# EAGLE design dcmctrl-mcu-board_v1 (EAGLE 6.2)
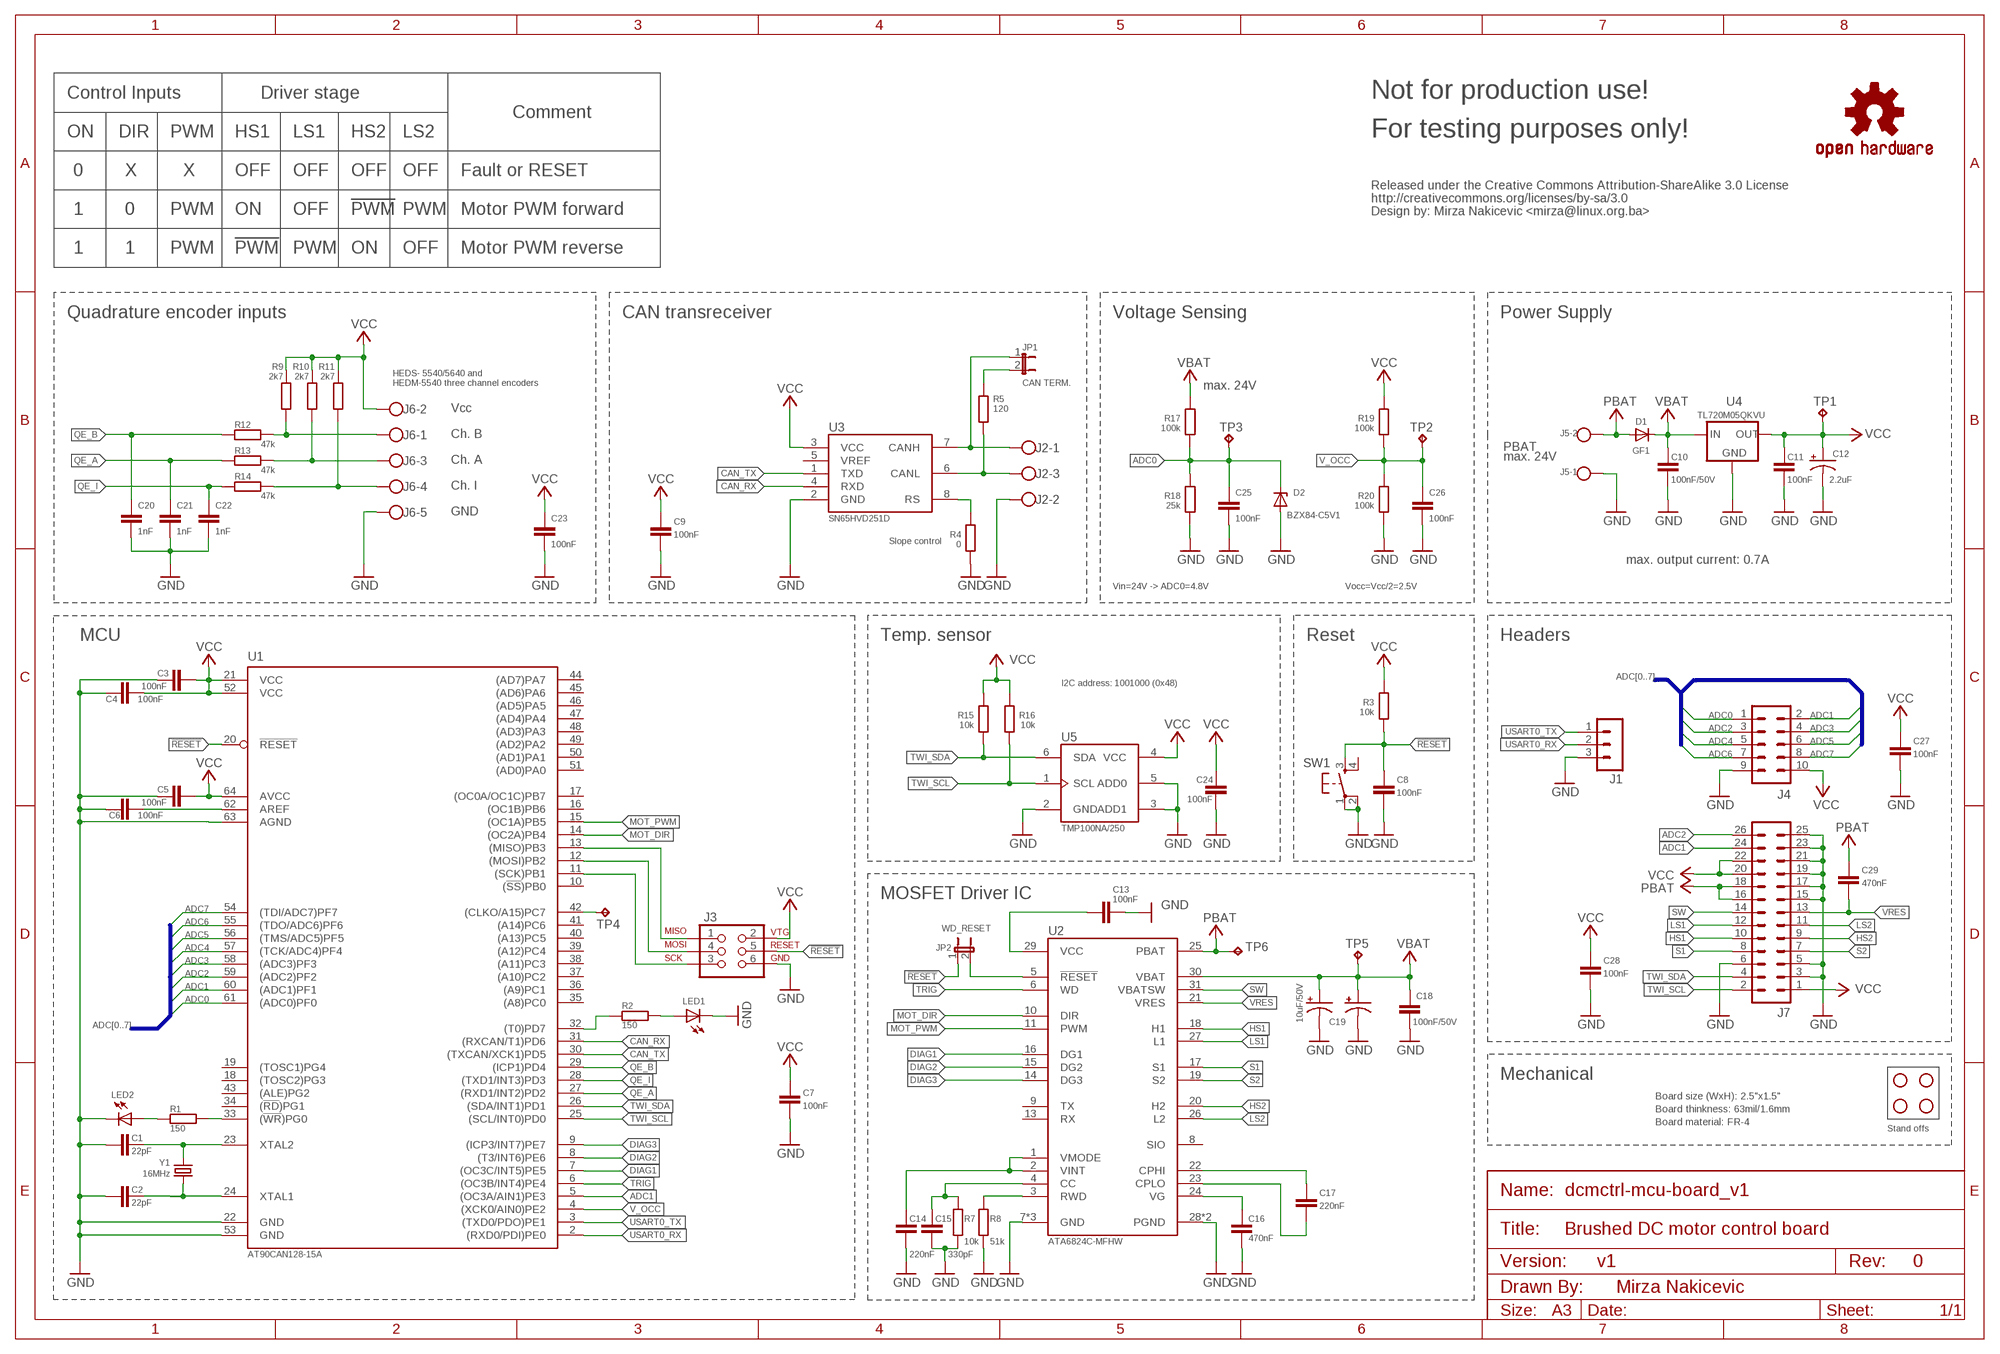
[diagram p0: schematic, sheet 1]

## Parts
C1  22pF  C-0603  [C0603]
C2  22pF  C-0603  [C0603]
C3  100nF  C-0603  [C0603]
C4  100nF  C-0603  [C0603]
C5  100nF  C-0603  [C0603]
C6  100nF  C-0603  [C0603]
C7  100nF  C-0603  [C0603]
C8  100nF  C-0603  [C0603]
C9  100nF  C-0603  [C0603]
C10  100nF/50V  C-0603  [C0603]
C11  100nF  C-0603  [C0603]
C12  2.2uF  CPOL-1206  [EIA3216]
C13  100nF  C-0603  [C0603]
C14  220nF  C-0603  [C0603]
C15  330pF  C-0603  [C0603]
C16  470nF  C-0603  [C0603]
C17  220nF  C-0603  [C0603]
C18  100nF/50V  C-0603  [C0603]
C19  10uF/50V  CPOL-3528  [EIA3528]
C20  1nF  C-0603  [C0603]
C21  1nF  C-0603  [C0603]
C22  1nF  C-0603  [C0603]
C23  100nF  C-0603  [C0603]
C24  100nF  C-0603  [C0603]
C25  100nF  C-0603  [C0603]
C26  100nF  C-0603  [C0603]
C27  100nF  C-0603  [C0603]
C28  100nF  C-0603  [C0603]
C29  470nF  C-0603  [C0603]
C999  10uF/50V  CPOL-PTH-2  [RADIAL-1]
D1  GF1  [SMA-DO214AC]
D2  BZX84-C5V1  ZENER-DIODETO236  [TO236]
J1  MA03-1  [MA03-1]
J2  BLOCK3-3.5-4UCON  [4UCON-20193]
J3  AVR-ISP-6-100  [2X3-100]
J4  MA05-2  [MA05-2]
J5  BLOCK2-3.5-4UCON  [4UCON-19963]
J6  BLOCK5-3.5-4UCON  [4UCON-20223]
J7  MA13-2  [MA13-2]
JP1  JUMPER-2PTH  [1X02]
JP2  JUMPER-2SMD-NC  [SJ_2S]
LED1  LEDCHIPLED_0603  [CHIPLED_0603]
LED2  LEDCHIPLED_0603  [CHIPLED_0603]
R1  150  R-0603  [R0603]
R2  150  R-0603  [R0603]
R3  10k  R-0603  [R0603]
R4  0  R-0603  [R0603]
R5  120  R-0805  [R0805]
R7  10k  R-0603  [R0603]
R8  51k  R-0603  [R0603]
R9  2k7  R-0603  [R0603]
R10  2k7  R-0603  [R0603]
R11  2k7  R-0603  [R0603]
R12  47k  R-0603  [R0603]
R13  47k  R-0603  [R0603]
R14  47k  R-0603  [R0603]
R15  10k  R-0603  [R0603]
R16  10k  R-0603  [R0603]
R17  100k  R-0603  [R0603]
R18  25k  R-0603  [R0603]
R19  100k  R-0603  [R0603]
R20  100k  R-0603  [R0603]
SW1  TAC_SWITCHPTH  [TACTILE-PTH]
TP1  TPB1,27  [B1,27]
TP2  TPB1,27  [B1,27]
TP3  TPB1,27  [B1,27]
TP4  TPB1,27  [B1,27]
TP5  TPB1,27  [B1,27]
TP6  TPB1,27  [B1,27]
U1  AT90CAN128-15A  [TQFP64]
U2  ATA6824C-MFHW  [TPQFP32]
U3  SN65HVD251D  [SO-08]
U4  TL720M05QKVU  [D-PAK_TO252AA]
U5  TMP100NA/250  [SOT23-6L]
U$1  STAND-OFF  [STAND-OFF]
U$2  STAND-OFF  [STAND-OFF]
U$3  STAND-OFF  [STAND-OFF]
U$4  STAND-OFF  [STAND-OFF]
U$24  OSHW-LOGOM  [OSHW-LOGO-M]
U$29  CC-SA  [CC-SA]
Y1  16MHz  CRYSTAL-HC49UV  [HC49U-V]

## Nets
!RESET: C8.1 J3.5 JP2.1 R3.1 SW1.3 U1.20(!RESET)
ADC0: C25.1 D2.C J4.1 R17.1 R18.2 TP3.TP U1.61((ADC0)PF0)
ADC1: J4.2 J7.24 U1.5((OC3A/AIN1)PE3) U1.60((ADC1)PF1)
ADC2: J4.3 J7.26 U1.59((ADC2)PF2)
ADC3: J4.4 U1.58((ADC3)PF3)
ADC4: J4.5 U1.57((TCK/ADC4)PF4)
ADC5: J4.6 U1.56((TMS/ADC5)PF5)
ADC6: J4.7 U1.55((TDO/ADC6)PF6)
ADC7: J4.8 U1.54((TDI/ADC7)PF7)
CAN_H: J2.1 JP1.1 U3.7(CANH)
CAN_L: J2.3 R5.2 U3.6(CANL)
CAN_RX: U1.31((RXCAN/T1)PD6) U3.4(RXD)
CAN_TX: U1.30((TXCAN/XCK1)PD5) U3.1(TXD)
DIAG1: U1.7((OC3C/INT5)PE5) U2.16(DG1)
DIAG2: U1.8((T3/INT6)PE6) U2.15(DG2)
DIAG3: U1.9((ICP3/INT7)PE7) U2.14(DG3)
GND: C1.2 C2.2 C3.2 C4.2 C5.2 C6.2 C7.2 C8.2 C9.2 C10.2 C11.2 C12.C(-) C13.2 C14.2 C15.2 C16.2 C18.2 C19.C(-) C20.2 C21.2 C22.2 C23.2 C24.2 C25.2 C26.2 C27.2 C28.2 C999.2(-) D2.A J1.3 J2.2 J3.6 J4.9 J5.1 J6.5 J7.3 J7.5 J7.6 J7.15 J7.17 J7.19 J7.21 J7.23 J7.25 LED1.C LED2.C R4.1 R7.1 R8.1 R18.1 R20.1 SW1.1 SW1.2 U1.22(GND) U1.53(GND) U1.63(AGND) U2.7(GND) U2.12(GND) U2.28(PGND) U2.32(GND) U2.33(PGND) U3.2(GND) U4.4(GND) U5.2(GND) U5.3(ADD1) U5.5(ADD0)
HS1: J7.10 U2.18(H1)
HS2: J7.9 U2.20(H2)
LS1: J7.12 U2.27(L1)
LS2: J7.11 U2.26(L2)
MOT_DIR: U1.14((OC2A)PB4) U2.10(DIR)
MOT_PWM: U1.15((OC1A)PB5) U2.11(PWM)
N$1: C1.1 U1.23(XTAL2) Y1.1
N$2: C2.1 U1.24(XTAL1) Y1.2
N$3: R4.2 U3.8(RS)
N$4: JP1.2 R5.1
N$5: R1.2 U1.33((!WR!)PG0)
N$6: C15.1 R7.2 U2.4(CC)
N$7: J3.1 U1.13((MISO)PB3)
N$8: R8.2 U2.3(RWD)
N$9: C14.1 U2.1(VMODE) U2.2(VINT)
N$10: C16.1 U2.24(VG)
N$11: C17.2 U2.23(CPLO)
N$12: C17.1 U2.22(CPHI)
N$13: C6.1 U1.62(AREF)
N$14: J3.4 U1.12((MOSI)PB2)
N$15: J3.3 U1.11((SCK)PB1)
N$16: TP4.TP U1.42((CLKO/A15)PC7)
N$17: C13.1 U2.29(VCC)
N$19: LED2.A R1.1
N$20: R2.2 U1.32((T0)PD7)
N$21: LED1.A R2.1
PBAT: C29.1 D1.A J5.2 J7.16 J7.18 TP6.TP U2.25(PBAT)
QE_A: C21.1 R13.1 U1.27((RXD1/INT2)PD2)
QE_A_IN: J6.3 R10.1 R13.2
QE_B: C20.1 R12.1 U1.29((ICP1)PD4)
QE_B_IN: J6.1 R9.1 R12.2
QE_I: C22.1 R14.1 U1.28((TXD1/INT3)PD3)
QE_I_IN: J6.4 R11.1 R14.2
S1: J7.8 U2.17(S1)
S2: J7.7 U2.19(S2)
SW: J7.14 U2.31(VBATSW)
TRIG: U1.6((OC3B/INT4)PE4) U2.6(WD)
TWI_SCL: J7.2 R16.1 U1.25((SCL/INT0)PD0) U5.1(SCL)
TWI_SDA: J7.4 R15.1 U1.26((SDA/INT1)PD1) U5.6(SDA)
USART0_RX: J1.2 U1.2((RXD0/PDI)PE0)
USART0_TX: J1.1 U1.3((TXD0/PDO)PE1)
V_OCC: C26.1 R19.1 R20.2 TP2.TP U1.4((XCK0/AIN0)PE2)
VBAT: C10.1 C18.1 C19.A(+) C999.1(+) D1.K(C) R17.2 TP5.TP U2.30(VBAT) U4.1(IN)
VCC: C3.1 C4.1 C5.1 C7.1 C9.1 C11.1 C12.A(+) C23.1 C24.1 C27.1 C28.1 J3.2 J4.10 J6.2 J7.1 J7.20 J7.22 R3.2 R9.2 R10.2 R11.2 R15.2 R16.2 R19.2 TP1.TP U1.21(VCC) U1.52(VCC) U1.64(AVCC) U3.3(VCC) U4.3(OUT) U5.4(VCC)
VRES: C29.2 J7.13 U2.21(VRES)
WD_RESET: JP2.2 U2.5(!RESET)
Unconnected: SW1.4 U1.10((!SS!)PB0) U1.16((OC1B)PB6) U1.17((OC0A/OC1C)PB7) U1.18((TOSC2)PG3) U1.19((TOSC1)PG4) U1.34((!RD!)PG1) U1.35((A8)PC0) U1.36((A9)PC1) U1.37((A10)PC2) U1.38((A11)PC3) U1.39((A12)PC4) U1.40((A13)PC5) U1.41((A14)PC6) U1.43((ALE)PG2) U1.44((AD7)PA7) U1.45((AD6)PA6) U1.46((AD5)PA5) U1.47((AD4)PA4) U1.48((AD3)PA3) U1.49((AD2)PA2) U1.50((AD1)PA1) U1.51((AD0)PA0) U2.8(SIO) U2.9(TX) U2.13(RX) U3.5(VREF)

## Buses
ADC[0..7]

## Notes on the sheet
- Control Inputs | Driver stage | Not for production use!
- Comment
- ON | DIR | PWM | HS1 | LS1 | HS2 | LS2 | For testing purposes only!
- 0 | X | X | OFF | OFF | OFF | OFF | Fault or RESET
- 1 | 0 | PWM | ON | OFF | !PWM | PWM | Motor PWM forward
- 1 | 1 | PWM | !PWM | PWM | ON | OFF | Motor PWM reverse
- Quadrature encoder inputs | CAN transreceiver | Voltage Sensing | Power Supply
- HEDS- 5540/5640 and
- HEDM-5540 three channel encoders | CAN TERM.
- max. 24V
- Vcc
- Ch. B
- PBAT
- Ch. A | max. 24V
- Ch. I
- GND
- Slope control
- max. output current: 0.7A
- Vin=24V -> ADC0=4.8V | Vocc=Vcc/2=2.5V
- MCU | Temp. sensor | Reset | Headers
- I2C address: 1001000 (0x48)
- MOSFET Driver IC
- WD_RESET
- Mechanical
- Board size (WxH): 2.5"x1.5"
- Board thinkness: 63mil/1.6mm
- Board material: FR-4
- Stand offs
- Brushed DC motor control board
- v1 | 0
- Mirza Nakicevic
- A3

## Library data of the parts
C1-C11 C13-C18 C20-C29 = rlc:C: Capacitor Standard SMD ceramic and 0.1" leaded capacitors.
C12 C19 C999 = rlc:CPOL: Capacitor Polarized These are standard SMD and PTH capacitors. Normally 10uF, 47uF, and 100uF in electrolytic and tantalum varieties. Always verify the external diameter of the through hole cap, it varies with capacity, voltage, and manufacturer. The EIA devices should be standard.
D1 = diode:GF1: DIODE
D2 = diode:ZENER-DIODE: Z-Diode
J1 = con-pinhead:MA03-1: PIN HEADER
J2 = con-block:BLOCK3
J3 = con-isp:AVR-ISP-6
J4 = con-pinhead:MA05-2: PIN HEADER; OC_FARNELL: unknown; OC_NEWARK: unknown
J5 = con-block:BLOCK2
J6 = con-block:BLOCK5
J7 = con-pinhead:MA13-2: PIN HEADER; OC_FARNELL: unknown; OC_NEWARK: unknown
JP1 JP2 = other:JUMPER-2: Jumper Basic 0.1" spaced jumper. Use with breakaway headers.
LED1 LED2 = led:LED: LED OSRAM: - CHIPLED LG R971, LG N971, LY N971, LG Q971, LY Q971, LO R971, LY R971 LH N974, LH R974 LS Q976, LO Q976, LY Q976 LO Q996 - Hyper CHIPLED LW Q18S LB Q993, LB Q99A, LB R99A - SideLED LS A670, LO A670, LY A670, LG A670, LP A670 LB A673, LV A673, LT A673, LW A673 LH A674 LY A675 LS A676, LA A676, LO A676, LY A676, LW A676 LS A679, LY A679, LG A679 - Hyper Micro SIDELED® LS Y876, LA Y876, LO Y876, LY Y876 LT Y87S - SmartLED LW L88C, LW L88S LB L89C, LB L89S, LG L890 LS L89K, LO L89K, LY L89K LS L896, LA L896, LO L896, LY L896 - TOPLED LS T670, LO T670, LY T670, LG T670, LP T670 LSG T670, LSP T670, LSY T670, LOP T670, LYG T670 LG T671, LOG T671, LSG T671 LB T673, LV T673, LT T673, LW T673 LH T674 LS T676, LA T676, LO T676, LY T676, LB T676, LH T676, LSB T676, LW T676 LB T67C, LV T67C, LT T67C, LS T67K, LO T67K, LY T67K, LW E67C LS E67B, LA E67B, LO E67B, LY E67B, LB E67C, LV E67C, LT E67C LW T67C LS T679, LY T679, LG T679 LS T770, LO T770, LY T770, LG T770, LP T770 LB T773, LV T773, LT T773, LW T773 LH T774 LS E675, LA E675, LY E675, LS T675 LS T776, LA T776, LO T776, LY T776, LB T776 LHGB T686 LT T68C, LB T68C - Hyper Mini TOPLED® LB M676 - Mini TOPLED Santana® LG M470 LS M47K, LO M47K, LY M47K Source: http://www.osram.convergy.de LUXEON: - LUMILED® LXK2-PW12-R00, LXK2-PW12-S00, LXK2-PW14-U00, LXK2-PW14-V00 LXK2-PM12-R00, LXK2-PM12-S00, LXK2-PM14-U00 LXK2-PE12-Q00, LXK2-PE12-R00, LXK2-PE12-S00, LXK2-PE14-T00, LXK2-PE14-U00 LXK2-PB12-K00, LXK2-PB12-L00, LXK2-PB12-M00, LXK2-PB14-N00, LXK2-PB14-P00, LXK2-PB14-Q00 LXK2-PR12-L00, LXK2-PR12-M00, LXK2-PR14-Q00, LXK2-PR14-R00 LXK2-PD12-Q00, LXK2-PD12-R00, LXK2-PD12-S00 LXK2-PH12-R00, LXK2-PH12-S00 LXK2-PL12-P00, LXK2-PL12-Q00, LXK2-PL12-R00 Source: www.luxeon.com KINGBRIGHT: KA-3528ASYC Source: www.kingbright.com
R1-R5 R7-R20 = rlc:R: Resistor Basic schematic elements and footprints for 0603, 1206, and PTH 1/10th watt (small) resistors.
SW1 = switch:TAC_SWITCH: Momentary Switch Button commonly used for reset or general input.
TP1-TP6 = testpad:TP: Test pad
U1 = mcu-avr:AT90CAN*
U2 = ic-drv:ATA6824
U3 = ic-if:SN65HVD251: INDUSTRIAL CAN TRANSCEIVER
U4 = ic-dcdc:TL720M05Q: LOW-DROPOUT VOLTAGE REGULATOR; GRADE: Q1
U5 = sens-temp:TMP100
U$1-U$4 = other:STAND-OFF: Stand Off This is the mechanical footprint for a #4 phillips button head screw. Use the keepout ring to avoid running the screw head into surrounding components.
U$24 = other:OSHW-LOGO: Open Source Hardware Logo This logo indicates the piece of hardware it is found on incorporates a OSHW license and/or adheres to the definition of open source hardware found here: http://freedomdefined.org/OSHW
U$29 = other:CC-SA
Y1 = crystal:CRYSTAL

## Board
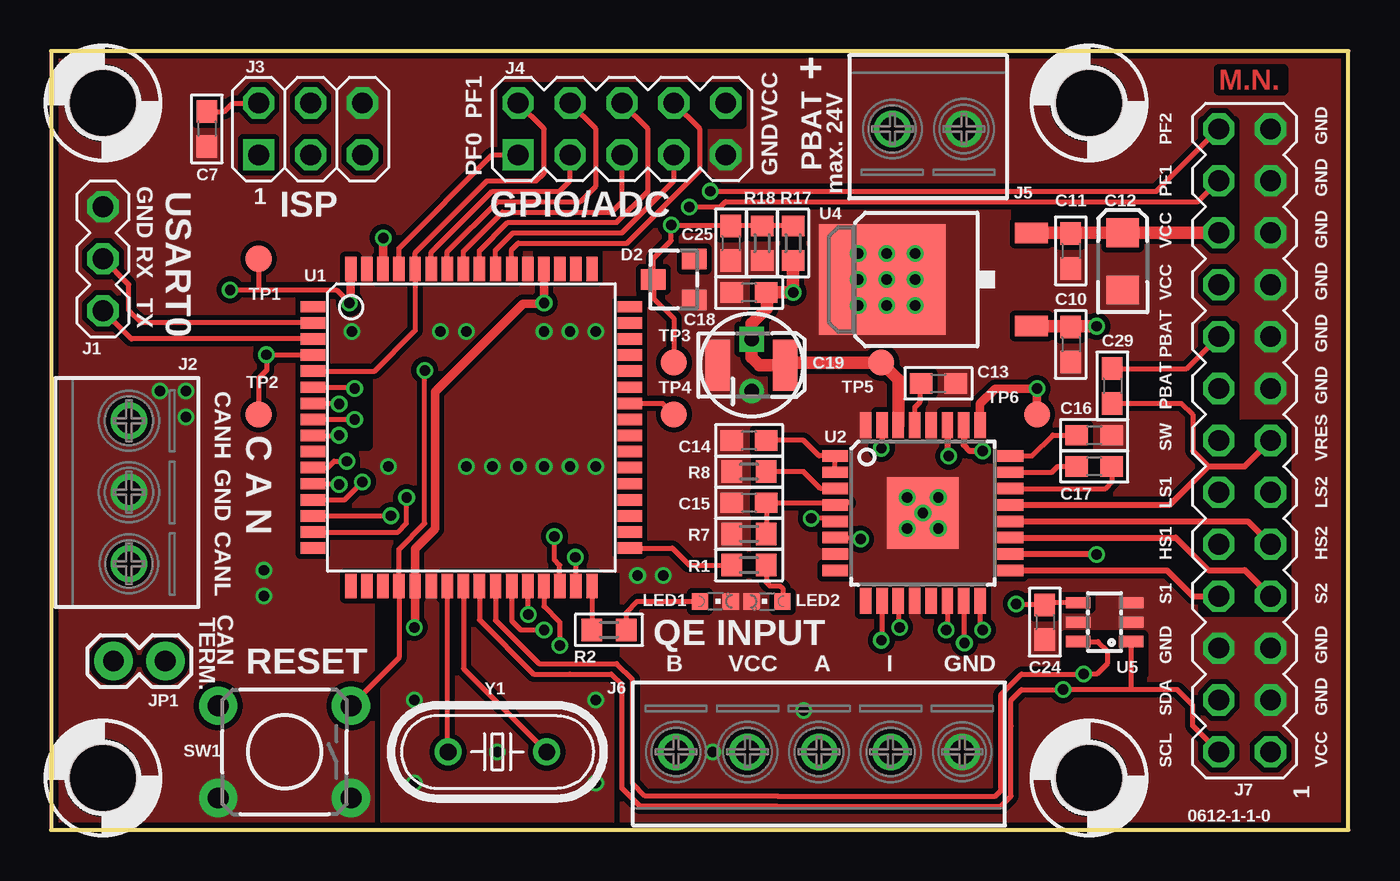
[diagram p1: board, top side]
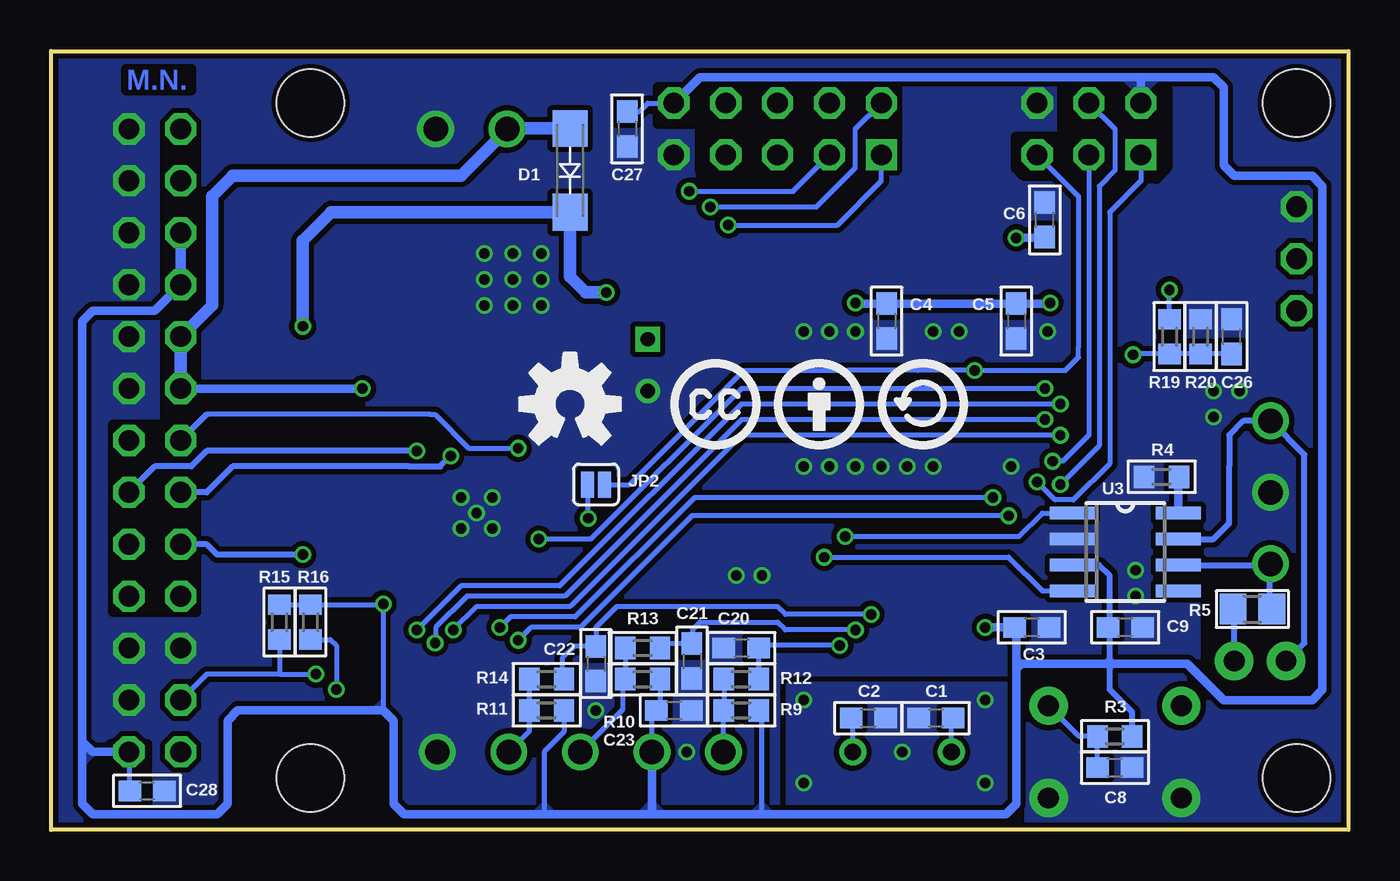
[diagram p2: board, bottom side, seen from below]

Size 63.5 x 38.1 mm. Coordinates in mm from the lower left corner, seen from the top.
Outline: 0,0 63.5,0 63.5,38.1 0,38.1 0,0
Copper layers (1*16): Top 0.035mm / dielectric 1.5mm / Bottom 0.035mm
Design rules: minimum track width 6mil, minimum drill 12mil, track to track 6mil, track to pad 6mil, pad to pad 6mil, via to via 6mil, smd to smd 0mil, copper to edge 10mil, drill to drill 10mil, minimum pad ring 10mil, minimum via ring 6mil, stop-mask expansion 2mil, vias tented up to drill 100mil, thermal gap 10mil
tRestrict: area 13.7,18.8 to 15.5,22.1; area 22.1,32.3 to 31.8,36.3; area 31.8,34.5 to 33.8,36.3; area 56.4,10.7 to 60.5,19.8; area 56.8,31.5 to 57.5,32; area 49.7,7.6 to 53.5,9.5; area 56.4,19.8 to 57.9,24.6; area 56.4,29 to 57.9,34.7; area 50.9,17.3 to 51.2,18.3; area 47.2,30 to 48.8,30.5
bRestrict: area 22.1,32.3 to 31.8,36.3; area 31.8,34.5 to 33.8,36.3; area 56.8,6 to 57.5,6.7; area 1.7,6.9 to 7,9.7; area 4.7,9.7 to 7,12.6; area 57.9,10.7 to 60.5,19.8; area 56.4,10.7 to 57.9,34.3; area 58.8,1.3 to 60.6,4.2; 17 lines

### Footprints (pad centres in the part's own frame; a part is rotated, then mirrored left to right if it is on the bottom)
C0603 = smd 1.1 x 1: 1 -0.85,0; 2 0.85,0
EIA3216 = smd 1.4 x 1.6: A 1.4,0; C -1.4,0
EIA3528 = smd 1.2 x 2.5: A 1.65,0; C -1.65,0
RADIAL-1 = drill 0.7 square: 1 1.27,0 | drill 0.7: 2 -1.27,0
SMA-DO214AC = smd 1.8 x 1.7: A -2.05,0; K 2.05,0
TO236 = smd 1 x 1.2: A -1,-1; C 0,1; NC 1,-1
MA03-1 = drill 1.016 octagon: 1 -2.54,0; 2 0,0; 3 2.54,0
4UCON-20193 = drill 1.2: 1 -3.5,0; 2 0,0; 3 3.5,0
2X3-100 = drill 1.016 square: 1 -2.54,-1.27 | drill 1.016 octagon: 2 -2.54,1.27; 3 0,-1.27; 4 0,1.27; 5 2.54,-1.27; 6 2.54,1.27
MA05-2 = drill 1.016 square: 1 -5.08,-1.27 | drill 1.016 octagon: 2 -5.08,1.27; 3 -2.54,-1.27; 4 -2.54,1.27; 5 0,-1.27; 6 0,1.27; 7 2.54,-1.27; 8 2.54,1.27; 9 5.08,-1.27; 10 5.08,1.27
4UCON-19963 = drill 1.2: 1 -1.75,0; 2 1.75,0
4UCON-20223 = drill 1.2: 1 -7,0; 2 -3.5,0; 3 0,0; 4 3.5,0; 5 7,0
MA13-2 = drill 1.016 octagon: 1 -15.24,-1.27; 2 -15.24,1.27; 3 -12.7,-1.27; 4 -12.7,1.27; 5 -10.16,-1.27; 6 -10.16,1.27; 7 -7.62,-1.27; 8 -7.62,1.27; 9 -5.08,-1.27; 10 -5.08,1.27; 11 -2.54,-1.27; 12 -2.54,1.27; 13 0,-1.27; 14 0,1.27; 15 2.54,-1.27; 16 2.54,1.27; 17 5.08,-1.27; 18 5.08,1.27; 19 7.62,-1.27; 20 7.62,1.27; 21 10.16,-1.27; 22 10.16,1.27; 23 12.7,-1.27; 24 12.7,1.27; 25 15.24,-1.27; 26 15.24,1.27
1X02 = drill 1.016 pad 1.88: 1 -1.27,0; 2 1.27,0
SJ_2S = smd 0.635 x 1.27: 1 -0.412,0; 2 0.412,0
CHIPLED_0603 = smd 0.8 x 0.8: A 0,-0.75; C 0,0.75
R0603 = smd 1 x 1.1: 1 -0.85,0; 2 0.85,0
R0805 = smd 1.3 x 1.5: 1 -0.95,0; 2 0.95,0
TACTILE-PTH = drill 1.016 pad 1.88: 1 -3.251,2.261; 2 3.251,2.261; 3 -3.251,-2.261; 4 3.251,-2.261
B1,27 = smd 1.27 x 1.27: TP 0,0
TQFP64 = smd 1.194 x 0.559: 1 -7.76,5.905; 2 -7.76,5.118; 3 -7.76,4.331; 4 -7.76,3.543; 5 -7.76,2.756; 6 -7.76,1.968; 7 -7.76,1.181; 8 -7.76,0.394; 9 -7.76,-0.394; 10 -7.76,-1.181; 11 -7.76,-1.968; 12 -7.76,-2.756; 13 -7.76,-3.543; 14 -7.76,-4.331; 15 -7.76,-5.118; 16 -7.76,-5.905; 33 7.76,-5.905; 34 7.76,-5.118; 35 7.76,-4.331; 36 7.76,-3.543; 37 7.76,-2.756; 38 7.76,-1.968; 39 7.76,-1.181; 40 7.76,-0.394; 41 7.76,0.394; 42 7.76,1.181; 43 7.76,1.968; 44 7.76,2.756; 45 7.76,3.543; 46 7.76,4.331; 47 7.76,5.118; 48 7.76,5.905 | smd 0.559 x 1.194: 17 -5.905,-7.76; 18 -5.118,-7.76; 19 -4.331,-7.76; 20 -3.543,-7.76; 21 -2.756,-7.76; 22 -1.968,-7.76; 23 -1.181,-7.76; 24 -0.394,-7.76; 25 0.394,-7.76; 26 1.181,-7.76; 27 1.968,-7.76; 28 2.756,-7.76; 29 3.543,-7.76; 30 4.331,-7.76; 31 5.118,-7.76; 32 5.905,-7.76; 49 5.905,7.76; 50 5.118,7.76; 51 4.331,7.76; 52 3.543,7.76; 53 2.756,7.76; 54 1.968,7.76; 55 1.181,7.76; 56 0.394,7.76; 57 -0.394,7.76; 58 -1.181,7.76; 59 -1.968,7.76; 60 -2.756,7.76; 61 -3.543,7.76; 62 -4.331,7.76; 63 -5.118,7.76; 64 -5.905,7.76
TPQFP32 = smd 1.27 x 0.559: 1 -4.293,2.8; 2 -4.293,2; 3 -4.293,1.2; 4 -4.293,0.4; 5 -4.293,-0.4; 6 -4.293,-1.2; 7 -4.293,-2; 8 -4.293,-2.8; 17 4.293,-2.8; 18 4.293,-2; 19 4.293,-1.2; 20 4.293,-0.4; 21 4.293,0.4; 22 4.293,1.2; 23 4.293,2; 24 4.293,2.8 | smd 0.559 x 1.27: 9 -2.8,-4.293; 10 -2,-4.293; 11 -1.2,-4.293; 12 -0.4,-4.293; 13 0.4,-4.293; 14 1.2,-4.293; 15 2,-4.293; 16 2.8,-4.293; 25 2.8,4.293; 26 2,4.293; 27 1.2,4.293; 28 0.4,4.293; 29 -0.4,4.293; 30 -1.2,4.293; 31 -2,4.293; 32 -2.8,4.293 | smd 3.5 x 3.5: 33 0,0
SO-08 = smd 0.6 x 2.2: 1 -1.905,-2.6; 2 -0.635,-2.6; 3 0.635,-2.6; 4 1.905,-2.6; 5 1.905,2.6; 6 0.635,2.6; 7 -0.635,2.6; 8 -1.905,2.6
D-PAK_TO252AA = smd 1 x 1.6: 1 -2.28,-4.8; 3 2.28,-4.8 | smd 5.4 x 6.2: 4 0,2.5
SOT23-6L = smd 0.55 x 1.2: 1 -0.95,-1.3; 2 0,-1.3; 3 0.95,-1.3; 4 0.95,1.3; 5 0,1.3; 6 -0.95,1.3
STAND-OFF = hole 3.302: 0,0
HC49U-V = drill 0.813: 1 -2.413,0; 2 2.413,0

### Placement (x,y rotation side)
C1  20.19,5.46 180 bottom
C2  23.5,5.46 0 bottom
C3  15.49,9.91 0 bottom
C4  22.61,24.89 270 bottom
C5  16.26,24.89 270 bottom
C6  14.86,29.84 90 bottom
C7  7.62,34.29 270 top
C8  11.43,3.05 0 bottom
C9  10.92,9.91 0 bottom
C10  49.91,23.75 270 top
C11  49.91,28.32 270 top
C12  52.45,27.81 90 top
C13  43.43,21.84 0 top
C14  34.16,19.05 180 top
C15  34.16,16 180 top
C16  51.05,19.3 0 top
C17  51.05,17.78 180 top
C18  34.16,26.29 180 top
C19  34.29,22.73 0 top
C20  29.72,8.89 180 bottom
C21  32.13,8.26 270 bottom
C22  36.83,8.13 270 bottom
C23  33.02,5.84 0 bottom
C24  48.64,10.16 270 top
C25  33.27,28.7 270 top
C26  5.71,24.13 90 bottom
C27  35.31,34.29 270 bottom
C28  58.8,1.91 0 bottom
C29  51.94,21.72 270 top
C999  34.29,22.73 90 top
D1  38.1,32.26 270 bottom
D2  30.48,26.92 90 top
J1  2.54,27.94 90 top
J2  3.81,16.51 270 top
J3  12.7,34.29 0 top
J4  27.94,34.29 0 top
J5  42.93,34.29 180 top
J6  37.59,3.81 0 top
J7  58.42,19.05 90 top
JP1  4.32,8.26 0 top
JP2  36.83,16.89 180 bottom
LED1  32.51,11.18 270 top
LED2  35.05,11.18 90 top
R1  34.16,12.95 180 top
R2  27.3,9.78 180 top
R3  11.43,4.57 0 bottom
R4  9.14,17.27 0 bottom
R5  4.7,10.79 0 bottom
R7  34.16,14.48 0 top
R8  34.16,17.53 0 top
R9  29.72,5.84 0 bottom
R10  34.54,7.37 0 bottom
R11  39.24,5.84 0 bottom
R12  29.72,7.37 180 bottom
R13  34.54,8.89 180 bottom
R14  39.24,7.37 180 bottom
R15  52.32,10.16 90 bottom
R16  50.8,10.16 90 bottom
R17  36.32,28.7 270 top
R18  34.8,28.7 90 top
R19  8.76,24.13 90 bottom
R20  7.24,24.13 270 bottom
SW1  11.43,3.81 180 top
TP1  10.16,27.94 0 top
TP2  10.16,20.32 0 top
TP3  30.48,22.86 0 top
TP4  30.48,20.32 0 top
TP5  40.64,22.86 0 top
TP6  48.26,20.32 0 top
U1  20.57,19.68 0 top
U2  42.67,15.49 0 top
U3  10.92,13.59 270 bottom
U4  43.18,26.92 90 top
U5  51.56,10.16 90 top
U$1  2.54,35.56 0 top
U$2  50.8,2.54 0 top
U$3  50.8,35.56 0 top
U$4  2.54,2.54 0 top
U$24  38.1,20.83 0 bottom
U$29  25.91,20.83 0 bottom
Y1  21.84,3.81 0 top

### Tracks (layer width: path | path; a pad name or v marks a point on that pad's centre or on a via)
!RESET  (via drill 0.51)
  Top 0.254: 14.73,6.12 SW1.3 17.03,8.42 U1.20 17.03,13.73 18.29,14.99 v18.29,22.48
  Bottom 0.254: C8.1 R3.1 13.18,4.57 SW1.3 | J3.5 13.21,30.99 13.21,23.62 13.21,23.11 13.84,22.48 v18.29,22.48 21.08,22.48 24.51,22.48 29.59,22.48 35.18,16.89 JP2.1
ADC0  (via drill 0.51)
  Top 0.254: R17.1 R18.2 C25.1 33.23,29.59 v30.35,29.59 30.35,28.83 29.48,27.96 D2.C 29.48,26.02 30.48,25.02 TP3.TP | 17.02,27.43 U1.61 17.03,28.46 21.59,33.02 J4.1
  Bottom 0.254: v30.35,29.59 25.02,29.59 22.86,31.75 J4.1
ADC1  (via drill 0.51)
  Top 0.254: U1.5 15.84,22.44 17.78,24.38 17.82,24.42 U1.60 17.82,28.23 21.34,31.75 23.75,31.75 24.13,32.13 24.13,34.29 J4.2 | v31.24,30.48 32.77,30.48 33.02,30.73 56.13,30.73 J7.24
  Bottom 0.254: v31.24,30.48 26.04,30.48 24.13,32.38 24.13,34.29 J4.2
ADC2  (via drill 0.51)
  Top 0.254: J4.3 25.4,31.75 24.89,31.24 21.59,31.24 18.61,28.26 U1.59 | v32.26,31.24 54.1,31.24 J7.26
  Bottom 0.254: v32.26,31.24 27.18,31.24 J4.3
ADC3
  Top 0.254: J4.4 26.67,34.29 26.67,32.26 26.67,31.5 25.91,30.73 21.84,30.73 19.39,28.28 U1.58
ADC4
  Top 0.254: J4.5 27.94,31.75 27.94,30.73 27.43,30.23 22.1,30.23 20.18,28.31 U1.57
ADC5
  Top 0.254: J4.6 29.21,34.29 29.21,32.26 29.21,31.24 27.69,29.72 22.35,29.72 20.97,28.33 U1.56
ADC6
  Top 0.254: J4.7 30.48,31.75 27.94,29.21 22.61,29.21 21.75,28.36 U1.55
ADC7
  Top 0.254: U1.54 22.54,28.38 22.86,28.7 28.19,28.7 31.75,32.26 31.75,34.29 J4.8
CAN_H
  Bottom 0.305: U3.7 6.6,14.22 5.84,14.99 5.84,17.78 5.84,19.3 5.14,20.01 J2.1 | J2.1 3.75,20.01 | JP1.1 2.16,9.14 2.16,18.36 J2.1
CAN_L
  Bottom 0.254: 3.87,12.95 J2.3 3.87,12.95
  Bottom 0.305: U3.6 3.87,12.95 3.87,10.91 R5.2
CAN_RX  (via drill 0.51)
  Top 0.254: U1.31 25.69,13.3 v25.65,13.34
  Bottom 0.254: 12.95,11.68 U3.4 14.99,11.68 16.64,13.34 v25.65,13.34
CAN_TX  (via drill 0.51)
  Top 0.254: U1.30 24.89,12.95 24.64,13.21 v24.64,14.35
  Bottom 0.254: v24.64,14.35 16.13,14.35 14.99,15.49 U3.1
DIAG1  (via drill 0.51)
  Top 0.254: U2.16 45.47,9.9 v45.59,9.78 | U1.7 14.06,20.87 v14.1,20.83
  Bottom 0.254: v14.1,20.83 21.46,20.83 24.64,20.83 29.72,20.83 38.61,11.94 43.43,11.94 v45.59,9.78
DIAG2  (via drill 0.51)
  Top 0.254: U2.15 44.67,9.18 v44.7,9.14 | U1.8 14.85,20.08 v14.86,20.07
  Bottom 0.254: v14.86,20.07 21.59,20.07 24.64,20.07 29.72,20.07 38.35,11.43 43.15,11.43 44.67,9.91 44.67,9.18 v44.7,9.14
DIAG3  (via drill 0.51)
  Top 0.254: U1.9 14.08,19.29 v14.1,19.3 | U2.14 43.87,9.84 v43.81,9.78
  Bottom 0.254: v14.1,19.3 21.72,19.3 24.64,19.3 29.72,19.3 38.1,10.92 42.67,10.92 v43.81,9.78
GND  (via drill 0.51)
  other vias: 26.67,24.38 16.51,17.78 22.86,17.78 24.13,17.78 36.83,5.84 39.5,26.92 40.89,26.92 42.29,26.92 39.5,28.19 40.89,28.19 42.29,28.19 39.5,25.65 40.89,25.65 42.29,25.65 41.91,16.26 43.43,16.26 43.43,14.73 41.91,14.73 42.67,15.49 25.4,24.38 32.38,3.81 29.97,12.45 20.32,24.38 19.05,24.38 21.84,3.81 17.78,2.29 26.67,2.29 26.67,6.35 10.41,11.43 6.6,20.19 6.6,21.46 10.41,12.7 21.59,17.78 20.32,17.78 25.4,17.78 26.67,17.78 24.13,24.38 14.73,24.38 17.78,6.35 28.7,12.45 5.33,21.46
  pour Bottom (isolate 0.254, no thermals): 0,0 15.75,0 15.75,7.62 27.94,7.62 27.94,0 63.5,0 63.5,38.1 0,38.1
  pour Top (isolate 0.254, no thermals): 0,0 15.75,0 15.75,12.7 27.94,12.7 27.94,0 63.5,0 63.5,38.1 0,38.1
  pour Top (isolate 0.254, no thermals): 16.26,0 16.26,12.7 27.43,12.7 27.43,0
  pour Bottom (isolate 0.254, no thermals): 16.26,7.11 27.43,7.11 27.43,0 16.26,0
HS1  (via drill 0.51)
  Top 0.305: U2.18 51.15,13.49 v51.18,13.46
  Bottom 0.305: v51.18,13.46 55.37,13.46 55.88,13.97 J7.10
HS2
  Top 0.305: U2.20 58.57,15.09 J7.9
LS1  (via drill 0.51)
  Top 0.305: U2.27 43.87,18.36 v43.94,18.29
  Bottom 0.305: v43.94,18.29 44.45,17.78 45.97,17.78 54.61,17.78 55.88,16.51 J7.12
LS2  (via drill 0.51)
  Top 0.305: U2.26 44.67,18.83 44.96,18.54 v45.59,18.54
  Bottom 0.305: v45.59,18.54 55.88,18.54 56.64,17.78 58.42,17.78 J7.11
MOT_DIR  (via drill 0.51)
  Top 0.254: U1.14 16.62,15.35 v16.64,15.37 | U2.10 40.67,9.3 v40.64,9.27
  Bottom 0.254: v16.64,15.37 24.38,15.37 27.05,15.37 32.13,15.37 37.59,9.91 40.01,9.91 v40.64,9.27
MOT_PWM  (via drill 0.51)
  Top 0.254: U1.15 16.98,14.57 17.4,14.99 v17.4,16.26 | U2.11 41.47,9.96 v41.53,9.91
  Bottom 0.254: v41.53,9.91 41.02,10.41 37.85,10.41 32,16.26 v17.4,16.26
N$1
  Top 0.254: U1.23 19.39,3.85 Y1.1
  Bottom 0.254: 19.39,5.41 C1.1 19.43,5.37 Y1.1
N$2
  Top 0.254: U1.24 20.18,7.89 Y1.2
  Bottom 0.254: Y1.2 24.26,5.37 C2.1
N$3
  Bottom 0.406: U3.8 8.32,17.24 R4.2
N$4
  Bottom 0.305: JP1.2 5.59,10.73 R5.1
N$5
  Top 0.254: U1.33 30.42,13.78 31.24,12.95 R1.2
N$6
  Top 0.254: R7.2 C15.1 39.03,16 U2.4
N$7  (via drill 0.51)
  Top 0.254: U1.13 14.36,16.14 v15.24,17.02
  Bottom 0.254: J3.1 10.16,31.75 11.68,30.23 11.68,17.92 13.46,16.14 14.36,16.14 v15.24,17.02
N$8
  Top 0.254: U2.3 37.66,16.69 36.83,17.53 R8.2
N$9
  Top 0.254: U2.2 U2.1 37.59,18.29 36.83,19.05 C14.1
N$10
  Top 0.254: U2.24 48.01,18.29 49.02,19.3 C16.1
N$11
  Top 0.254: U2.23 48.99,17.49 49.28,17.78 C17.2
N$12
  Top 0.254: U2.22 51.62,16.69 51.94,17.02 51.94,17.74 C17.1
N$13  (via drill 0.51)
  Top 0.406: U1.62 16.24,28.94 v16.26,28.96
  Bottom 0.406: v16.26,28.96 14.9,28.96 C6.1
N$14  (via drill 0.51)
  Top 0.254: U1.12 14.06,16.93 v14.1,16.89
  Bottom 0.254: J3.4 11.43,34.29 11.43,32.51 11.43,32.26 12.19,31.5 12.19,18.8 v14.1,16.89
N$15  (via drill 0.51)
  Top 0.254: U1.11 13.53,17.72 13.84,18.03 v14.48,18.03
  Bottom 0.254: J3.3 12.7,19.3 13.97,18.03 v14.48,18.03
N$16
  Top 0.254: U1.42 29.93,20.87 TP4.TP
N$17
  Top 0.254: U2.29 42.27,20.68 42.55,20.95 42.55,21.8 C13.1
N$19
  Top 0.254: R1.1 35.01,12.1 35.18,11.94 35.69,11.94 35.81,11.81 35.81,11.19 LED2.A
N$20
  Top 0.254: U1.32 26.48,9.8 R2.2
N$21
  Top 0.254: R2.1 28.16,10.63 28.7,11.18 LED1.A
PBAT  (via drill 0.51)
  Top 0.254: C29.1 55.59,22.57 J7.18
  Top 0.305: TP6.TP 48.51,20.32
  Top 0.406: U2.25 45.47,20.83 46.23,21.59 v48.26,21.59 TP6.TP
  Bottom 0.406: J7.16 v48.26,21.59
  Bottom 0.61: J7.16 J7.18 55.63,25.65 55.63,26.92 55.63,30.99 54.61,32 47.75,32 43.43,32 41.18,34.26 J5.2 41.15,34.32 D1.A
QE_A  (via drill 0.51)
  Top 0.254: U1.27 22.54,10.22 22.99,9.78 v24.13,9.78
  Bottom 0.254: R13.1 33.48,9.11 C21.1 32.09,9.14 32.09,9.82 31.75,10.16 27.94,10.16 27.56,9.78 v24.13,9.78
QE_A_IN
  Bottom 0.254: R13.2 R10.1 35.52,7.24 35.52,5.88 J6.3
QE_B  (via drill 0.51)
  Top 0.254: U1.29 24.12,10.94 24.89,10.16 v24.89,9.02
  Bottom 0.254: R12.1 C20.1 28.74,9.02 v24.89,9.02
QE_B_IN
  Bottom 0.254: J6.1 30.59,5.82 R9.1 R12.2
QE_I  (via drill 0.51)
  Top 0.254: U1.28 23.33,10.58 v23.37,10.54
  Bottom 0.254: v23.37,10.54 27.56,10.54 27.94,10.92 35.81,10.92 36.83,9.91 C22.1 37.88,8.98 38.48,8.38 38.48,7.45 R14.1
QE_I_IN
  Bottom 0.254: J6.4 40.09,4.81 R11.1 R14.2
S1
  Top 0.305: U2.17 54.62,12.69 55.88,11.43 J7.8
S2
  Top 0.305: U2.19 55.05,14.29 56.64,12.7 58.42,12.7 J7.7
SW  (via drill 0.51)
  Top 0.254: U2.31 40.67,18.7 v40.64,18.67
  Bottom 0.254: v40.64,18.67 43.05,18.67 44.7,20.32 44.96,20.32 55.88,20.32
  Bottom 0.305: 55.88,20.32 J7.14
TRIG  (via drill 0.51)
  Top 0.254: U1.6 14.8,21.65 v14.86,21.59 | U2.6 39.44,14.29 v39.62,14.22
  Bottom 0.254: v14.86,21.59 21.34,21.59 24.64,21.59 29.72,21.59 37.08,14.22 v39.62,14.22
TWI_SCL  (via drill 0.51)
  Top 0.254: U1.25 20.97,10.27 23.62,7.62 25.4,7.62 27.43,7.62 27.94,7.11 27.94,2.03 28.83,1.14 35.56,1.14 46.48,1.14 46.99,1.65 46.99,5.08 46.99,6.35 47.5,6.86 v49.53,6.86 52.83,6.86 | J7.2 55.88,5.08 55.88,6.1 55.12,6.86 52.83,6.86 | U5.1 52.86,6.89 52.83,6.86
  Bottom 0.254: R16.1 49.82,9.31 49.53,9.02 v49.53,6.86
TWI_SDA  (via drill 0.51)
  Top 0.254: U5.6 51.24,9.21 51.69,8.76 51.69,8.13 51.18,7.62 v50.55,7.62 47.5,7.62 46.48,6.6 46.48,5.21 46.48,1.91 46.23,1.65 35.56,1.65 29.08,1.65 28.45,2.29 28.45,7.37 27.69,8.13 25.65,8.13 23.88,8.13 21.75,10.25 U1.26
  Bottom 0.254: 52.32,7.62 v50.55,7.62 | R15.1 52.32,7.62 | 52.32,7.62 55.88,7.62 J7.4
USART0_RX
  Top 0.254: U1.2 4.41,24.8 3.81,25.4 3.81,26.67 J1.2
USART0_TX
  Top 0.254: U1.3 3.92,24.02 J1.1
V_OCC  (via drill 0.51)
  Top 0.254: U1.4 10.55,23.23 | 10.55,23.23 v10.54,23.24 | 10.55,23.23 10.55,22.49 10.16,22.1 TP2.TP
  Bottom 0.254: C26.1 R20.2 R19.1 10.76,23.28 v10.54,23.24
VBAT  (via drill 0.51)
  Top 0.508: 49.87,24.64 C10.1 49.95,24.64
  Top 0.61: U2.30 41.47,22.03 TP5.TP 36.07,22.86 C19.A 34.67,22.73 34.29,23.11 C999.1 34.29,24.77 35.05,25.53 35.05,26.25 C18.1 v36.32,26.29 R17.2 | U4.1 49.87,24.64 | v51.18,24.64 49.95,24.64
  Bottom 0.61: 38.12,30.23 D1.K | v51.18,24.64 51.18,28.83 49.78,30.23 38.12,30.23 | 38.12,30.23 D1.K | v36.32,26.29 37.34,26.29 38.1,27.05 D1.K
VCC  (via drill 0.51)
  Top 0.254: C7.1 8.47,35.14 8.89,35.56 J3.2 | 48.74,11.11 C24.1 | C24.1 47.28,11.01 v47.24,11.05 | U5.4 48.74,11.11 | 48.74,11.11 C24.1 | v8.76,26.42 10.16,26.42 | 10.16,26.42 13.97,26.42 v14.61,25.78 | TP1.TP 10.16,26.42
  Top 0.406: v17.78,9.91 17.82,9.94 U1.21 17.82,13.75 18.8,14.73 18.8,21.42 23.11,25.74 24.09,25.74 v24.13,25.78 24.12,25.79 U1.52 | U1.64 14.67,25.84 v14.61,25.78
  Top 0.508: 49.88,29.2 C11.1
  Top 0.61: U4.3 49.88,29.2 | J7.22 C12.A 49.95,29.21 C11.1
  Bottom 0.254: C27.1 34.71,35.14 34.29,35.56 J4.10 | J6.2 34.09,5.62 C23.1 33.69,6.02 R10.2 | R15.2 R16.2 47.28,11.01 v47.24,11.05 47.24,8.76 47.24,8.13 47.24,7.37 47.24,5.84 | 29.38,0.8 29.34,0.76 | R11.2 38.39,4.79 39.37,3.81 39.37,0.76 | R19.2 v8.76,26.42 | C28.1 59.65,3.77 J7.1 | 28.7,0.76 28.7,5.68 R9.2
  Bottom 0.305: R3.2 10.58,5.75 11.68,6.86 11.68,8.13 11.68,9.82 C9.1 11.68,9.99 11.68,12.45 12.19,12.95 U3.3
  Bottom 0.406: 10.16,36.83 6.6,36.83 6.1,36.32 6.1,32.51 5.59,32 1.78,32 1.27,31.5 1.27,19.3 1.27,16.64 1.27,13.97 1.27,11.43 1.27,9.4 1.27,6.86 1.78,6.35 6.1,6.35 7.87,8.13 9.14,8.13 11.68,8.13 12.19,8.13 16,8.13 16.26,7.87 | J4.10 31.75,36.83 10.16,36.83 | 16.26,7.87 16.26,1.27 16.76,0.76 28.7,0.76 29.34,0.76 29.46,0.76 33.53,0.76 34.04,0.76 | J7.20 58.42,25.4 61.47,25.4 61.98,24.89 61.98,5.59 61.98,4.32 | 61.98,4.32 61.98,3.81 61.98,1.27 61.47,0.76 55.37,0.76 54.86,1.27 54.86,5.33 54.36,5.84 47.24,5.84 46.74,5.33 46.74,1.27 46.23,0.76 41.91,0.76 39.37,0.76 34.8,0.76 34.54,0.76 34.29,0.76 34.04,0.76 | v17.78,9.91 C3.1 16.26,9.82 16.26,7.87 | v14.61,25.78 14.64,25.74 C5.1 C4.1 24.09,25.74 v24.13,25.78 | J7.1 61.47,3.81 61.98,4.32 | J6.2 34.09,0.82 34.04,0.76 | 10.16,36.83 J3.2
  Bottom 0.508: J7.22 J7.20
  pour Bottom: 39.37,0.76 39.88,0.76 39.37,1.27 38.86,0.76
  pour Bottom: 33.59,0.76 34.61,0.76 34.1,1.27
  pour Bottom: 61.98,4.32 61.98,3.3 61.47,3.81
  pour Bottom: 16.26,7.87 16.26,8.38 16,8.13
  pour Bottom: 11.43,8.13 11.94,8.13 11.68,8.38
  pour Bottom: 11.43,8.13 11.94,8.13 11.68,7.87
  pour Bottom: 47.24,5.84 47.75,5.84 47.24,6.35
  pour Bottom (isolate 0.254, no thermals): 10.16,36.83 10.92,36.83 10.16,36.07 9.4,36.83
  pour Bottom (isolate 0.254, no thermals): 28.7,0.76 29.21,0.76 28.7,1.27 28.19,0.76
VRES
  Top 0.254: C29.2 55.33,20.87 55.88,20.32 55.88,18.54 56.64,17.78
  Top 0.305: U2.21 54.63,15.89 54.76,15.89 56.64,17.78 58.42,17.78 J7.13
WD_RESET  (via drill 0.51)
  Top 0.254: U2.5 37.99,15.09 37.85,15.24 v37.21,15.24
  Bottom 0.254: v37.21,15.24 37.21,16.86 JP2.2

### Text on the board
Top: M.N.
Bottom: M.N.
tPlace: + | PF1 | VCC | PF2 | GND | PF0 | GND | PBAT | GND | USART0 | 1 | max. 24V | PF1 | GND | ISP | GPIO/ADC | RX | VCC | GND | TX | VCC | GND | PBAT | GND | CANH | PBAT | GND | C A N | SW | GND | VRES | LS1 | LS2 | CANL | HS1 | HS2 | CAN | S1 | S2 | TERM. | QE INPUT | RESET | B | VCC | A | I | GND | GND | GND | SDA | GND | SCL | VCC | 1 | 0612-1-1-0